# EasyEDA Pro project ProPrj_NRF9151 GILBERTO8_2026-06-28.epro, schematic JCONNECTOR_GILBERTO
Board Name: Board1; Create Date: 2026-04-15; Page Name: P1_nrf9151; Project Name: NRF9151 GILBERTO; Schematic Name: JCONNECTOR_GILBERTO; Update Date: 2026-04-29; Company: EasyEDA.com; Page Size: A4; Version: V1.0
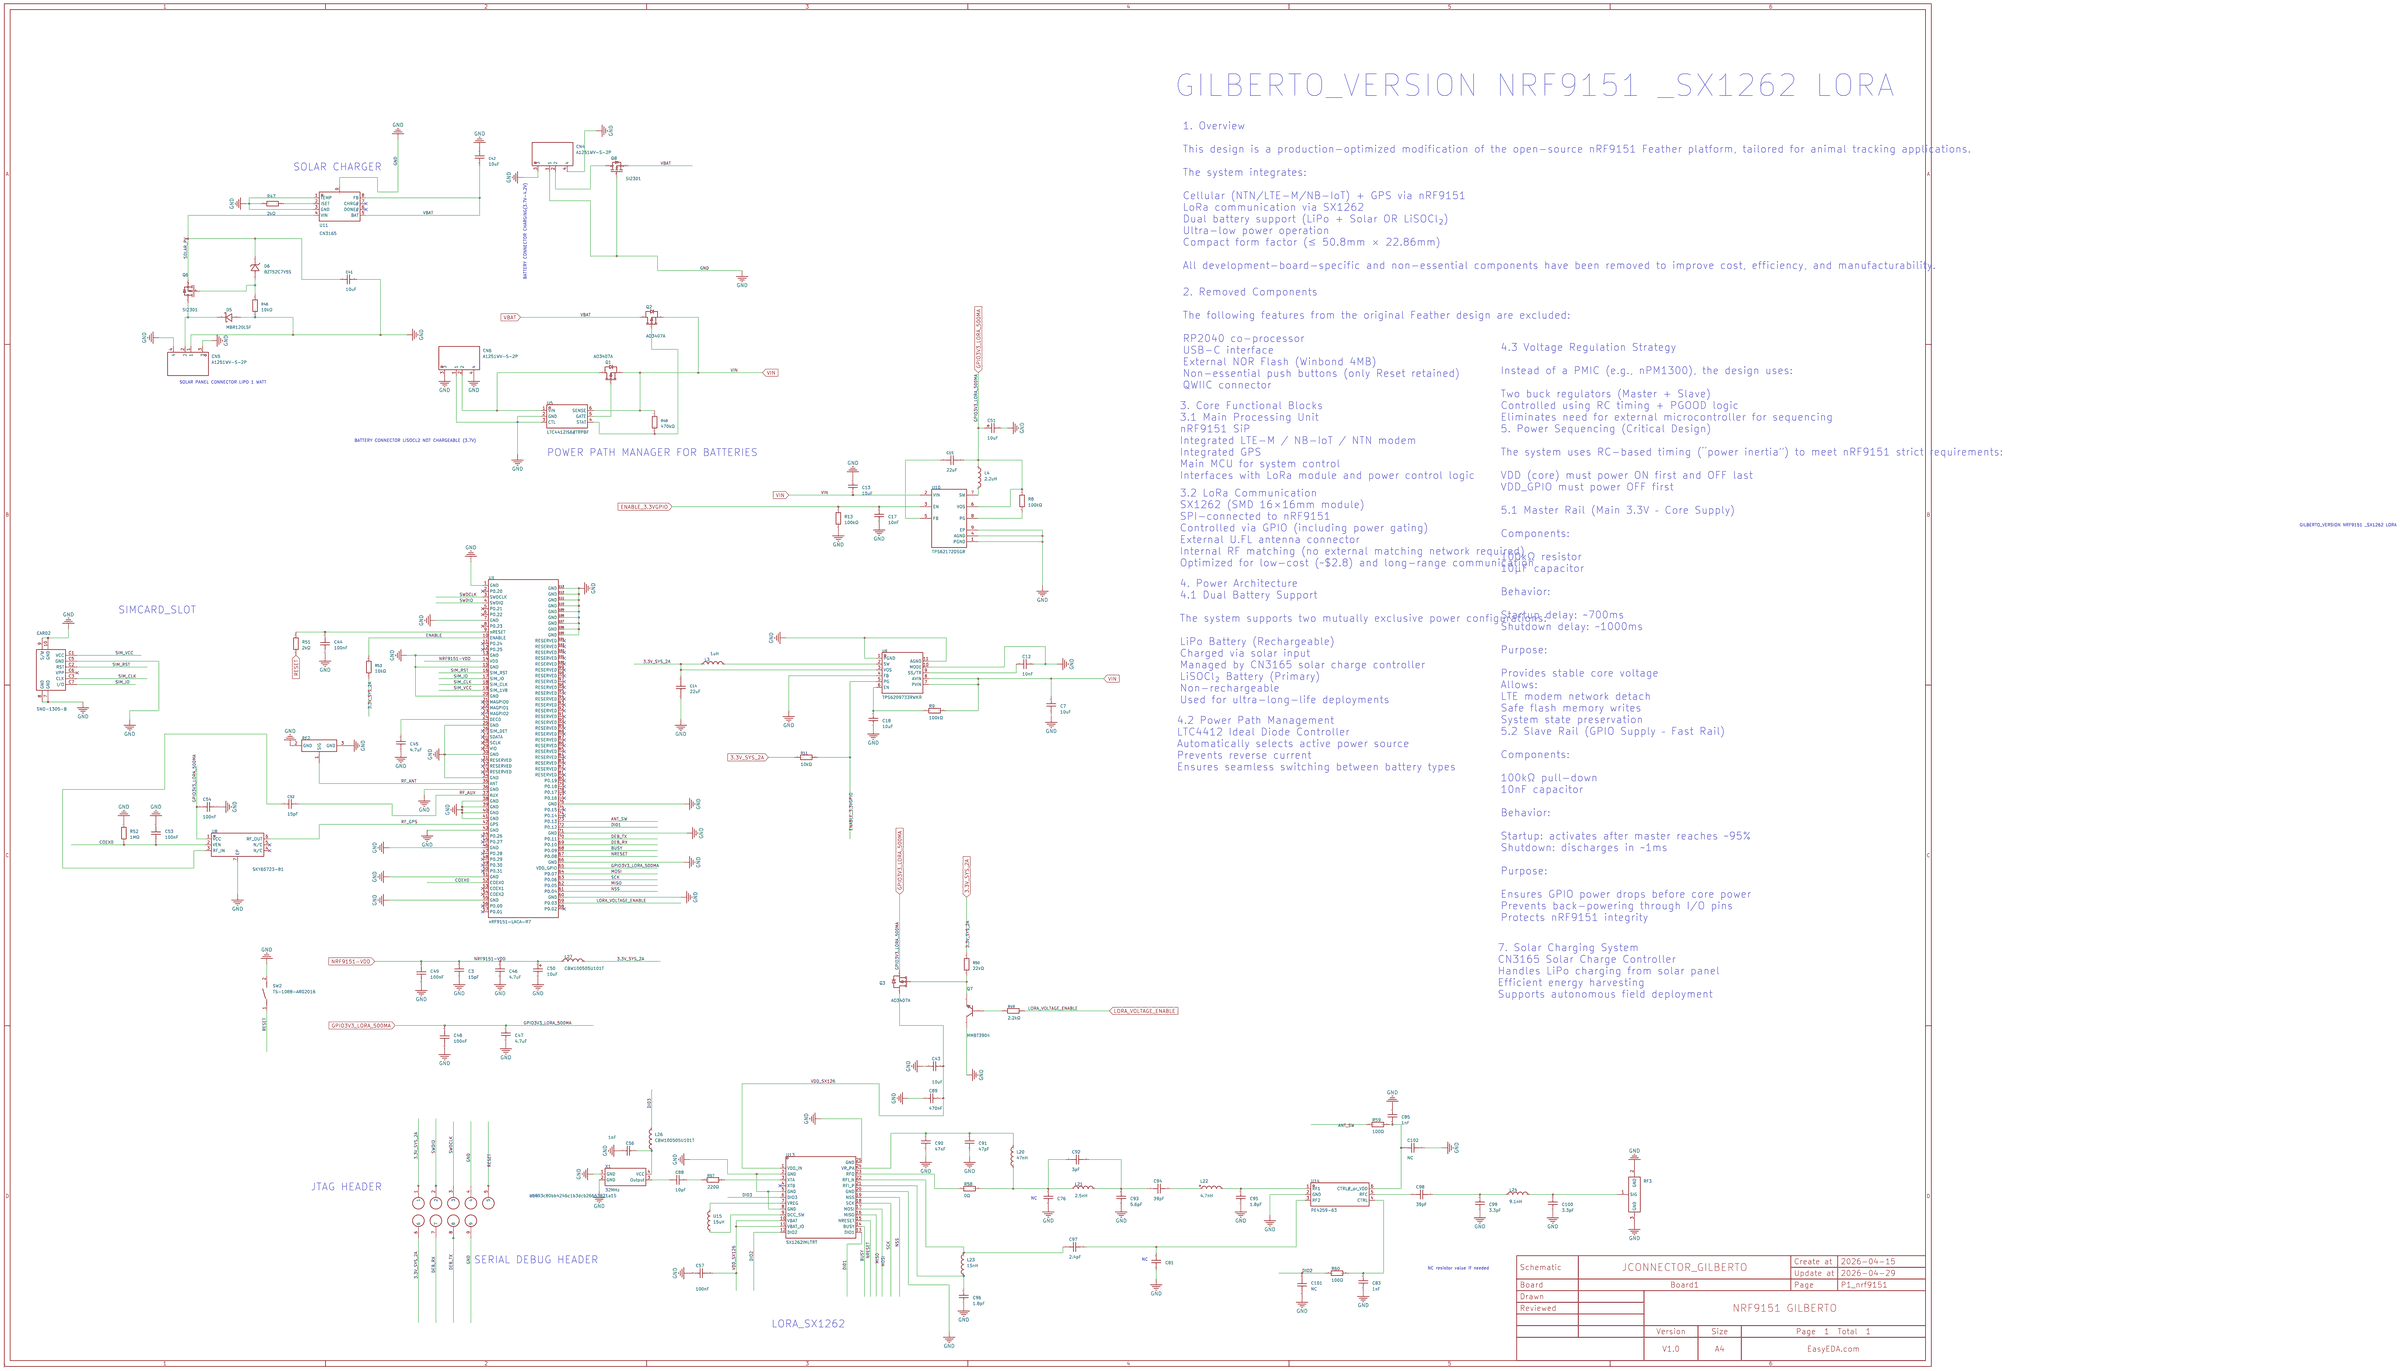
[diagram p0: schematic sheet]

## Parts
C3  15pF  [C0402]
C7  10uF  [C0402]
C12  10nF  [C0402]
C13  10uF  [C0402]
C14  22uF  [C0603]
C15  22uF  [C0603]
C17  10nF  [C0402]
C18  10uF  [C0402]
C41  10uF  [C0402]
C42  10uF  [C0402]
C43  10uF  [C0402]
C44  100nF  [C0402]
C45  4.7uF  [C0402]
C46  4.7uF  [C0402]
C47  4.7uF  [C0402]
C48  100nF  [C0402]
C49  100nF  [C0402]
C50  10uF  [CASE-A_3216]
C51  10uF  [CASE-A_3216]
C52  15pF  [C0201]
C53  100nF  [C0201]
C54  100nF  [C0201]
C56  1nF  [C0402]
C57  100nF  [C0402]
C76  1nF  [C0402]
C81  1nF  [C0402]
C83  1nF  [C0402]
C85  1nF  [C0402]
C88  10pF  [C0402]
C89  470nF  [C0402]
C90  47nF  [C0402]
C91  47pF  [C0402]
C92  3pF  [C0402]
C93  5.6pF  [C0402]
C94  39pF  [C0402]
C95  1.8pF  [C0402]
C96  1.8pF  [C0402]
C97  2.4pF  [C0402]
C98  39pF  [C0402]
C99  3.3pF  [C0402]
C100  3.3pF  [C0402]
C101  NC  [C0603]
C102  NC  [C0603]
CARD2  SNO-1305-B  [SIM-SMD_SIM-1305-6P]
CN4  A1251WV-S-2P  [CONN-SMD_2P-P1.25_A1251WV-S-2P]
CN5  A1251WV-S-2P  [CONN-SMD_2P-P1.25_A1251WV-S-2P]
CN6  A1251WV-S-2P  [CONN-SMD_2P-P1.25_A1251WV-S-2P]
D5  MBR120LSF  [SOD-123_L2.8-W1.8-LS3.7-RD]
D6  BZT52C7V5S  [SOD-323_L1.8-W1.3-LS2.5-RD]
L3  1uH  [IND-SMD_L3.0-W3.0_SWPA3010S]
L4  2.2uH  [L0806]
L20  47nH  [L0402]
L21  2.5nH  [L0201]
L22  4.7nH  [L0402-R-RD]
L23  15nH  [L0402]
L24  9.1nH  [L0402]
L26  CBW100505U101T  [L0402]
L27  CBW100505U101T  [L0402]
Q1  AO3407A  [SOT-23_L2.9-W1.3-P1.90-LS2.4-BR]
Q2  AO3407A  [SOT-23_L2.9-W1.3-P1.90-LS2.4-BR]
Q3  AO3407A  [SOT-23_L2.9-W1.3-P1.90-LS2.4-BR]
Q6  SI2301  [SOT-23-3_L2.9-W1.3-P1.90-LS2.4-BR]
Q7  MMBT3904  [SOT-23-3_L2.9-W1.3-P1.90-LS2.4-BR]
Q8  SI2301  [SOT-23-3_L2.9-W1.3-P1.90-LS2.4-BR]
R8  100kΩ  [R0603]
R9  100kΩ  [R0603]
R11  10kΩ  [R0402]
R13  100kΩ  [R0603]
R46  10kΩ  [R0201]
R47  2kΩ  [R0402]
R48  470kΩ  [R0805]
R49  2.2kΩ  [R0402]
R50  22kΩ  [R0402]
R51  2kΩ  [R0402]
R52  1MΩ  [R0402]
R53  10kΩ  [R0402]
R57  220Ω  [R0402]
R58  0Ω  [R0402]
R59  100Ω  [R0402]
R60  100Ω  [R0402]
RF2  6GHz  [RF-SMD_FRF05002-JSS103M]
RF3  6GHz  [RF-SMD_FRF05002-JSS103M]
SW2  TS-1088-AR02016  [SW-SMD_L3.9-W3.0-P4.45]
U1  nRF9151-LACA-R7  [LGA-113_L12.1-W11.1_NRF9151-LACA-R7]
U5  LTC4412IS6#TRPBF  [SOT-23-6_L2.9-W1.6-P0.95-LS2.8-BL]
U8  SKY65723-81  [MCM-6_L2.3-W1.7-P0.54-TL-EP]
U9  TPS6209733RWKR  [VQFN-11_L2.0-W2.0-P0.50-TL_TI_RWK]
U10  TPS62172DSGR  [WSON-8_L2.0-W2.0-P0.50-TL-EP]
U11  CN3165  [DFN-8_L3.0-W3.0-P0.50-BL-EP]
U13  SX1262IMLTRT  [QFN-24_L4.0-W4.0-P0.50-BL-EP2.6]
U14  PE4259-63  [SC-70-6_L2.2-W1.3-P0.65-LS2.1-BL]
U15  15uH  [L0603]
U16  e0493c80bb4246c1b3dcb26663821a15  [J CONNEXCO]
X1  32MHz  [OSC-SMD_4P-L2.0-W1.6-BL_1XXD]

## Library data of the parts
C3 = 0402CG150J500NT: Capacitance:15pF Tolerance:±5% Tolerance:±5% Voltage Rating:50V Temperature Coefficient:C0G; LCSC Part Name: 15pF ±5% 50V; Supplier Part: C1548; Manufacturer: FH(风华); Supplier Footprint: 0402; Datasheet: https://item.szlcsc.com/datasheet/0402CG150J500NT/1900.html; Supplier: LCSC; Tolerance: ±5%; Voltage Rating: 50V; Temperature Coefficient: C0G
C7 C13 C18 C43 = CL05A106MQ5NUNC: Capacitance:10uF Tolerance:±20% Tolerance:±20% Voltage Rating:6.3V Temperature Coefficient:X5R; LCSC Part Name: 10uF ±20% 6.3V; Supplier Part: C15525; Manufacturer: SAMSUNG(三星); Supplier Footprint: 0402; JLCPCB Part Class: Basic Part; Datasheet: https://item.szlcsc.com/datasheet/CL05A106MQ5NUNC/16204.html; Supplier: LCSC; Tolerance: ±20%; Voltage Rating: 6.3V; Temperature Coefficient: X5R
C12 C17 = 0402B103K500NT: Capacitance:10nF Tolerance:±10% Tolerance:±10% Voltage Rating:50V Temperature Coefficient:X7R; LCSC Part Name: 10nF ±10% 50V; Supplier Part: C1524; Manufacturer: FH(风华); Supplier Footprint: 0402; Datasheet: https://item.szlcsc.com/datasheet/0402B103K500NT/1876.html; Supplier: LCSC; Tolerance: ±10%; Voltage Rating: 50V; Temperature Coefficient: X7R
C14 C15 = GRM188R60J226MEA0D: Capacitance:22uF Tolerance:±20% Tolerance:±20% Voltage Rating:6.3V Temperature Coefficient:X5R; LCSC Part Name: 22uF ±20% 6.3V; Supplier Part: C77042; Manufacturer: muRata(村田); Supplier Footprint: 0603; Datasheet: https://item.szlcsc.com/datasheet/GRM188R60J226MEA0D/78169.html; Supplier: LCSC; Tolerance: ±20%; Voltage Rating: 6.3V; Temperature Coefficient: X5R
C41 C42 = CL05A106MP5NUNC_C315248: Capacitance:10uF Tolerance:±20% Tolerance:±20% Voltage Rating:10V Temperature Coefficient:X5R; LCSC Part Name: 10uF ±20% 10V; Supplier Part: C315248; Manufacturer: SAMSUNG(三星); Manufacturer Part: CL05A106MP5NUNC; Supplier Footprint: 0402; JLCPCB Part Class: Extended Part; Datasheet: https://item.szlcsc.com/datasheet/CL05A106MP5NUNC/297154.html; Supplier: LCSC; Tolerance: ±20%; Voltage Rating: 10V; Temperature Coefficient: X5R
C44 C48 C49 C57 = CL05B104KO5NNNC: Capacitance:100nF Tolerance:±10% Tolerance:±10% Voltage Rating:16V Temperature Coefficient:X7R; LCSC Part Name: 100nF ±10% 16V; Supplier Part: C1525; Manufacturer: SAMSUNG(三星); Supplier Footprint: 0402; JLCPCB Part Class: Basic Part; Datasheet: https://item.szlcsc.com/datasheet/CL05B104KO5NNNC/1877.html; Supplier: LCSC; Tolerance: ±10%; Voltage Rating: 16V; Temperature Coefficient: X7R
C45-C47 = C1005X5R0J475MTJ00E: Capacitance:4.7uF Tolerance:±20% Tolerance:±20% Voltage Rating:6.3V Temperature Coefficient:X5R; LCSC Part Name: 4.7uF ±20% 6.3V; Supplier Part: C23687; Manufacturer: TDK; Supplier Footprint: 0402; Datasheet: https://item.szlcsc.com/datasheet/C1005X5R0J475MTJ00E/24423.html; Supplier: LCSC; Tolerance: ±20%; Voltage Rating: 6.3V; Temperature Coefficient: X5R
C50 C51 = TAJA106K010RNJ: Capacitance:10uF Tolerance:±10% Tolerance:±10% Voltage Rating:10V Equivalent Series Resistance(ESR):3Ω@100kHz Operating Temperature:-55℃~+125℃ Operating Temperature:-55℃~+125℃; LCSC Part Name: 10uF ±10% 10V; Supplier Part: C7177; Manufacturer: Kyocera AVX; Supplier Footprint: CASE-A-3216-18(mm); Supplier: LCSC; Tolerance: ±10%; Voltage Rating: 10V; Equivalent Series Resistance(ESR): 3Ω@100kHz; Operating Temperature: -55℃~+125℃
C52 = 0201CG150J500NT: Capacitance:15pF Tolerance:±5% Tolerance:±5% Voltage Rating:50V Temperature Coefficient:C0G; LCSC Part Name: 15pF ±5% 50V; Supplier Part: C64554; Manufacturer: FH(风华); Supplier Footprint: 0201; Datasheet: https://item.szlcsc.com/datasheet/0201CG150J500NT/65621.html; Supplier: LCSC; Tolerance: ±5%; Voltage Rating: 50V; Temperature Coefficient: C0G
C53 C54 = CL03A104KP3NNNC: Capacitance:100nF Tolerance:±10% Tolerance:±10% Voltage Rating:10V Temperature Coefficient:X5R; LCSC Part Name: 100nF ±10% 10V; Supplier Part: C49062; Manufacturer: SAMSUNG(三星); Supplier Footprint: 0201; JLCPCB Part Class: Extended Part; Datasheet: https://item.szlcsc.com/datasheet/CL03A104KP3NNNC/50070.html; Supplier: LCSC; Tolerance: ±10%; Voltage Rating: 10V; Temperature Coefficient: X5R
C56 = 0402CG102J500NT: Capacitance:1nF Tolerance:±5% Tolerance:±5% Voltage Rating:50V Temperature Coefficient:C0G; LCSC Part Name: 1nF ±5% 50V; Supplier Part: C53547; Manufacturer: FH(风华); Supplier Footprint: 0402; JLCPCB Part Class: Extended Part; Datasheet: https://item.szlcsc.com/datasheet/0402CG102J500NT/54563.html; Supplier: LCSC; Tolerance: ±5%; Voltage Rating: 50V; Temperature Coefficient: C0G
C76 C81 C83 C85 = 0402B102K500NT: Capacitance:1nF Tolerance:±10% Tolerance:±10% Voltage Rating:50V Temperature Coefficient:X7R; LCSC Part Name: 1nF ±10% 50V; Supplier Part: C1523; Manufacturer: FH(风华); Supplier Footprint: 0402; Datasheet: https://item.szlcsc.com/datasheet/0402B102K500NT/1875.html; Supplier: LCSC; Tolerance: ±10%; Voltage Rating: 50V; Temperature Coefficient: X7R
C88 = 0402CG100J500NT: Capacitance:10pF Tolerance:±5% Tolerance:±5% Voltage Rating:50V Temperature Coefficient:C0G; LCSC Part Name: 10pF ±5% 50V; Supplier Part: C1545; Manufacturer: FH(风华); Supplier Footprint: 0402; Datasheet: https://item.szlcsc.com/datasheet/0402CG100J500NT/1897.html; Supplier: LCSC; Tolerance: ±5%; Voltage Rating: 50V; Temperature Coefficient: C0G
C89 = CL05A474KP5NNNC: Capacitance:470nF Tolerance:±10% Tolerance:±10% Voltage Rating:10V Temperature Coefficient:X5R; LCSC Part Name: 470nF ±10% 10V; Supplier Part: C47339; Manufacturer: SAMSUNG(三星); Supplier Footprint: 0402; Datasheet: https://item.szlcsc.com/datasheet/CL05A474KP5NNNC/48344.html; Supplier: LCSC; Tolerance: ±10%; Voltage Rating: 10V; Temperature Coefficient: X5R
C90 = GRM155R71C473KA01D: Capacitance:47nF Tolerance:±10% Tolerance:±10% Voltage Rating:16V Temperature Coefficient:X7R; LCSC Part Name: 47nF ±10% 16V; Supplier Part: C77012; Manufacturer: muRata(村田); Supplier Footprint: 0402; JLCPCB Part Class: Extended Part; Datasheet: https://item.szlcsc.com/datasheet/GRM155R71C473KA01D/78139.html; Supplier: LCSC; Tolerance: ±10%; Voltage Rating: 16V; Temperature Coefficient: X7R
C91 = GRM1555C1H470JA01D: Capacitance:47pF Tolerance:±5% Tolerance:±5% Voltage Rating:50V Temperature Coefficient:C0G; LCSC Part Name: 47pF ±5% 50V; Supplier Part: C76970; Manufacturer: muRata(村田); Supplier Footprint: 0402; JLCPCB Part Class: Extended Part; Datasheet: https://item.szlcsc.com/datasheet/GRM1555C1H470JA01D/78097.html; Supplier: LCSC; Tolerance: ±5%; Voltage Rating: 50V; Temperature Coefficient: C0G
C92 = GJM1555C1H3R0BB01D: Capacitance:3pF Voltage Rating:50V Temperature Coefficient:C0G; LCSC Part Name: ±0.1pF 3pF 50V; Supplier Part: C88891; Manufacturer: muRata(村田); Supplier Footprint: 0402; Datasheet: https://item.szlcsc.com/datasheet/GJM1555C1H3R0BB01D/90071.html; Supplier: LCSC; Voltage Rating: 50V; Temperature Coefficient: C0G
C93 = GRM1555C1H5R6BA01D: Capacitance:5.6pF Voltage Rating:50V Temperature Coefficient:C0G; LCSC Part Name: ±0.1pF 5.6pF 50V; Supplier Part: C76976; Manufacturer: muRata(村田); Supplier Footprint: 0402; JLCPCB Part Class: Extended Part; Datasheet: https://item.szlcsc.com/datasheet/GRM1555C1H5R6BA01D/78103.html; Supplier: LCSC; Voltage Rating: 50V; Temperature Coefficient: C0G
C94 C98 = GCM1555C1H390JA16D: Capacitance:39pF Tolerance:±5% Tolerance:±5% Voltage Rating:50V Temperature Coefficient:C0G; LCSC Part Name: 39pF ±5% 50V; Supplier Part: C343867; Manufacturer: muRata(村田); Supplier Footprint: 0402; JLCPCB Part Class: Extended Part; Datasheet: https://item.szlcsc.com/datasheet/GCM1555C1H390JA16D/320719.html; Supplier: LCSC; Tolerance: ±5%; Voltage Rating: 50V; Temperature Coefficient: C0G
C95 C96 = GJM1555C1H1R8BB01D: Capacitance:1.8pF Voltage Rating:50V Temperature Coefficient:C0G; LCSC Part Name: ±0.1pF 1.8pF 50V; Supplier Part: C76902; Manufacturer: muRata(村田); Supplier Footprint: 0402; JLCPCB Part Class: Extended Part; Datasheet: https://item.szlcsc.com/datasheet/GJM1555C1H1R8BB01D/78029.html; Supplier: LCSC; Voltage Rating: 50V; Temperature Coefficient: C0G
C97 = GJM1555C1H2R4BB01D: Capacitance:2.4pF Voltage Rating:50V Temperature Coefficient:C0G; LCSC Part Name: ±0.1pF 2.4pF 50V; Supplier Part: C88888; Manufacturer: muRata(村田); Supplier Footprint: 0402; JLCPCB Part Class: Extended Part; Datasheet: https://item.szlcsc.com/datasheet/GJM1555C1H2R4BB01D/90068.html; Supplier: LCSC; Voltage Rating: 50V; Temperature Coefficient: C0G
C99 C100 = GJM1555C1H3R3BB01D: Capacitance:3.3pF Voltage Rating:50V Temperature Coefficient:C0G; LCSC Part Name: ±0.1pF 3.3pF 50V; Supplier Part: C76906; Manufacturer: muRata(村田); Supplier Footprint: 0402; Datasheet: https://item.szlcsc.com/datasheet/GJM1555C1H3R3BB01D/78033.html; Supplier: LCSC; Voltage Rating: 50V; Temperature Coefficient: C0G
C101 C102 = CAP_0603: Supplier Footprint: 0603
CARD2 = SNO-1305-B: Card Connection Mode:Hinged Lid Card Type:Nano-SIM Card Connector Type:Connector and Ejector Card Detection:No Card Detect Height Above Board:1.4mm Operating Temperature:-35℃~+75℃ Operating Temperature:-35℃~+75℃; LCSC Part Name: 翻盖式 NanoSIM卡 卡座; Supplier Part: C111371; Manufacturer: SOFNG(硕方); Supplier Footprint: SMD; JLCPCB Part Class: Extended Part; Datasheet: https://item.szlcsc.com/datasheet/SNO-1305-B/112597.html; Supplier: LCSC; Card Connection Mode: Hinged Lid; Card Type: Nano-SIM Card; Connector Type: Connector and Ejector; Card Detection: No Card Detect; Height Above Board: 1.4mm; Operating Temperature: -35℃~+75℃
CN4-CN6 = A1251WV-S-2P: Pins Structure:1x2P Pitch:1.25mm Mounting Type:Surface Mount,Vertical Reference Series:- Number of Pins:2P Number of Rows:1 Number of PINs Per Row:2 Row Spacing:- Current Rating:1A Contact Material:Phosphor Bronze Contact Plating:Tin Operating Temperature; LCSC Part Name: 1x2P 间距:1.25mm 立贴; Supplier Part: C225104; Manufacturer: CJT(长江连接器); Supplier Footprint: SMD,P=1.25mm; JLCPCB Part Class: Extended Part; Datasheet: https://item.szlcsc.com/datasheet/A1251WV-S-2P/225387.html; Supplier: LCSC; Pins Structure: 1x2P; Pitch: 1.25mm; Mounting Type: Surface Mount,Vertical; Number of Pins: 2P; Number of Rows: 1; Number of PINs Per Row: 2; Current Rating: 1A; Contact Material: Phosphor Bronze; Contact Plating: Tin; Operating Temperature: -40℃~+105℃; Voltage Rating: 125V; Plastic Material: LCP; Flame Retardant Rating: UL94V-0
D5 = MBR120LSF: Diode Configuration:Independent Voltage - Forward(Vf@If):600mV@1A Voltage - DC Reverse(Vr):20V Current - Rectified:1A Reverse Leakage Current (Ir):1mA@20V Non-Repetitive Peak Forward Surge Current:25A; LCSC Part Name: 电压:20V 电流:1A; Supplier Part: C130880; Manufacturer: SHIKUES(时科); Supplier Footprint: SOD-123; JLCPCB Part Class: Extended Part; Datasheet: https://item.szlcsc.com/datasheet/MBR120LSF/142169.html; Supplier: LCSC; Diode Configuration: Independent; Voltage - Forward(Vf@If): 600mV@1A; Voltage - DC Reverse(Vr): 20V; Current - Rectified: 1A; Reverse Leakage Current (Ir): 1mA@20V; Non-Repetitive Peak Forward Surge Current: 25A
D6 = BZT52C7V5S_C5270778: Diode Configuration:1 Independent Zener Voltage(Nom):7V Reverse Leakage Current (Ir):1uA@5V Zener Voltage(Range):7.5V~7.9V Zener Voltage(Range):7.5V~7.9V Pd - Power Dissipation:200mW Impedance(Zzt):15Ω Impedance(Zzk):80Ω; LCSC Part Name: 独立式 耐压:7V 电流:1uA@5.0V; Supplier Part: C5270778; Manufacturer: YFW(佑风微); Supplier Footprint: SOD-323; JLCPCB Part Class: Extended Part; Datasheet: https://item.szlcsc.com/datasheet/BZT52C7V5S/5997207.html; Supplier: LCSC; Diode Configuration: 1 Independent; Zener Voltage(Nom): 7V; Reverse Leakage Current (Ir): 1uA@5V; Zener Voltage(Range): 7.5V~7.9V; Pd - Power Dissipation: 200mW; Impedance(Zzt): 15Ω; Impedance(Zzk): 80Ω
L3 = SWPA3015S1R0NT: Inductance: Tolerance:±30% Tolerance:±30% Rated Current: Current - Saturation(Isat):2.8A DC Resistance(DCR): Type:- Ratings:-; LCSC Part Name: 1uH ±30% 2.8A; Supplier Part: C43388; Manufacturer: Sunlord(顺络); Supplier Footprint: SMD,3x3mm; JLCPCB Part Class: Extended Part; Datasheet: https://atta.szlcsc.com/upload/public/pdf/source/20231024/317626D2AA2F8AB4113C1875E432E6E1.pdf; Supplier: LCSC; Tolerance: ±30%; Current - Saturation(Isat): 2.8A
L4 = MLP2016V2R2MT0S1: Inductance:2.2uH Tolerance:±20% Tolerance:±20% Current Rating:1A Current - Saturation (Isat):- DC Resistance(DCR):170mΩ Q @ Frequency:- Frequency - Self Resonant:- Ratings:-; LCSC Part Name: 2.2uH ±20%; Supplier Part: C307746; Manufacturer: TDK; Supplier Footprint: 0806; JLCPCB Part Class: Extended Part; Datasheet: https://item.szlcsc.com/datasheet/MLP2016V2R2MT0S1/291420.html; Supplier: LCSC; Tolerance: ±20%; Current Rating: 1A; DC Resistance(DCR): 170mΩ
L20 = LQG15HH47NH02D: Inductance: Tolerance:±3% Tolerance:±3% Rated Current: Saturation Current (Isat):- DC Resistance (DCR): Q @ Freq:8@100MHz Frequency - Self Resonant: Ratings:AEC-Q200; LCSC Part Name: 47nH ±3%; Supplier Part: C2042001; Manufacturer: muRata(村田); Supplier Footprint: 0402; JLCPCB Part Class: Extended Part; Datasheet: https://atta.szlcsc.com/upload/public/pdf/source/20201110/C913594_35623EBE2A582BB18A46746E227A8E3C.pdf; Supplier: LCSC; Tolerance: ±3%; Q @ Freq: 8@100MHz; Ratings: AEC-Q200
L21 = LQP03HQ2N5B02D: Inductance: Tolerance:- Tolerance:- Rated Current: Saturation Current (Isat):- DC Resistance (DCR): Q @ Freq:20@500MHz Frequency - Self Resonant:9GHz Ratings: Type:Thick Film Inductor; Supplier Part: C237441; Manufacturer: muRata(村田); Supplier Footprint: 0201; Datasheet: https://atta.szlcsc.com/upload/public/pdf/source/20181120/C333991_3B037B5A0300CC3F313E5A09B9D1E037.pdf; Supplier: LCSC; Q @ Freq: 20@500MHz; Frequency - Self Resonant: 9GHz; Type: Thick Film Inductor
L22 = LQG15HS4N7S02D: Inductance:4.7nH Tolerance:- Tolerance:- Current Rating:700mA Current - Saturation (Isat):- DC Resistance(DCR):160mΩ Q @ Frequency:8@100MHz Frequency - Self Resonant:6GHz Ratings:-; Supplier Part: C86065; Manufacturer: muRata(村田); Supplier Footprint: 0402; Datasheet: https://item.szlcsc.com/datasheet/LQG15HS4N7S02D/87241.html; Supplier: LCSC; Current Rating: 700mA; DC Resistance(DCR): 160mΩ; Q @ Frequency: 8@100MHz; Frequency - Self Resonant: 6GHz
L23 = LQG15HS15NJ02D: Inductance:15nH Tolerance:±5% Tolerance:±5% Current Rating:450mA Current - Saturation (Isat):- DC Resistance(DCR):320mΩ Q @ Frequency:8@100MHz Frequency - Self Resonant:2.5GHz Ratings:-; LCSC Part Name: 15nH ±5%; Supplier Part: C86059; Manufacturer: muRata(村田); Supplier Footprint: 0402; JLCPCB Part Class: Extended Part; Datasheet: https://item.szlcsc.com/datasheet/LQG15HS15NJ02D/87235.html; Supplier: LCSC; Tolerance: ±5%; Current Rating: 450mA; DC Resistance(DCR): 320mΩ; Q @ Frequency: 8@100MHz; Frequency - Self Resonant: 2.5GHz
L24 = LQG15HN9N1J02D: Inductance: Tolerance:±5% Tolerance:±5% Rated Current: Saturation Current (Isat):- DC Resistance (DCR): Q @ Freq:8@100MHz Frequency - Self Resonant: Ratings:; LCSC Part Name: 9.1nH ±5%; Supplier Part: C113059; Manufacturer: muRata(村田); Supplier Footprint: 0402; Datasheet: https://atta.szlcsc.com/upload/public/pdf/source/20170523/1495533989819.pdf; Supplier: LCSC; Tolerance: ±5%; Q @ Freq: 8@100MHz
L26 L27 = CBW100505U101T: Impedance @ Frequency:100Ω@100MHz Tolerance:±25% Tolerance:±25% DC Resistance(DCR):200mΩ Current Rating:450mA Number of Circuits:1; LCSC Part Name: 单路 0402磁珠 阻抗100Ω@100MHz; Supplier Part: C124089; Manufacturer: FH(风华); Supplier Footprint: 0402; Datasheet: https://item.szlcsc.com/datasheet/CBW100505U101T/125363.html; Supplier: LCSC; Impedance @ Frequency: 100Ω@100MHz; Tolerance: ±25%; DC Resistance(DCR): 200mΩ; Current Rating: 450mA; Number of Circuits: 1
Q1-Q3 = AO3407A_C347478: Number:1 P-Channel Drain to Source Voltage:30V Current - Continuous Drain(Id):4.2A RDS(on):37mΩ@10V；52mΩ@4.5V Pd - Power Dissipation:1.4W Gate Threshold Voltage (Vgs(th)):1.8V@250uA Gate Charge(Qg):14.3nC@4.5V Input Capacitance(Ciss):700pF Reverse Transfe; LCSC Part Name: 1个P沟道 耐压:30V 电流:4.2A; Supplier Part: C347478; Manufacturer: UMW(友台半导体); Supplier Footprint: SOT-23; Datasheet: https://item.szlcsc.com/datasheet/AO3407A/324138.html; Supplier: LCSC; Number: 1 P-Channel; Drain to Source Voltage: 30V; Current - Continuous Drain(Id): 4.2A; RDS(on): 37mΩ@10V；52mΩ@4.5V; Pd - Power Dissipation: 1.4W; Gate Threshold Voltage (Vgs(th)): 1.8V@250uA; Gate Charge(Qg): 14.3nC@4.5V; Input Capacitance(Ciss): 700pF; Reverse Transfer Capacitance (Crss@Vds): 75pF
Q6 Q8 = SI2301_C181086: Number:1 P-Channel Drain to Source Voltage:20V Current - Continuous Drain(Id):3A RDS(on):115mΩ@2.5V,1.0A Pd - Power Dissipation:1.6W Gate Threshold Voltage (Vgs(th)):1V@250uA Gate Charge(Qg):10nC@4.5V Input Capacitance(Ciss):405pF Reverse Transfer Capacit; LCSC Part Name: 1个P沟道 耐压:20V 电流:3A; Supplier Part: C181086; Manufacturer: Hottech(合科泰); Supplier Footprint: SOT-23; JLCPCB Part Class: Extended Part; Datasheet: https://item.szlcsc.com/datasheet/SI2301/192483.html; Supplier: LCSC; Number: 1 P-Channel; Drain to Source Voltage: 20V; Current - Continuous Drain(Id): 3A; RDS(on): 115mΩ@2.5V,1.0A; Pd - Power Dissipation: 1.6W; Gate Threshold Voltage (Vgs(th)): 1V@250uA; Gate Charge(Qg): 10nC@4.5V; Input Capacitance(Ciss): 405pF; Reverse Transfer Capacitance (Crss@Vds): 55pF; Operating Temperature: -55℃~+150℃; Type: P-Channel; Output Capacitance(Coss): 75pF
Q7 = MMBT3904_C84104: type:NPN Current - Collector(Ic):200mA Collector - Emitter Voltage VCEO:40V Pd - Power Dissipation:350mW DC Current Gain:100@10mA,1V DC Current Gain:100@10mA,1V Transition frequency(fT):300MHz Current - Collector Cutoff:50nA Vce Saturation(VCE(sat)):300mV; LCSC Part Name: 此款型号丝印有4种:1AM,1E,T1A,T04,会随机发货 NPN 电流:200mA 电压:40V; Supplier Part: C84104; Manufacturer: ST(先科); Supplier Footprint: SOT-23; Datasheet: https://item.szlcsc.com/datasheet/MMBT3904/85272.html; Supplier: LCSC; type: NPN; Current - Collector(Ic): 200mA; Collector - Emitter Voltage VCEO: 40V; Pd - Power Dissipation: 350mW; DC Current Gain: 100@10mA,1V; Transition frequency(fT): 300MHz; Current - Collector Cutoff: 50nA; Vce Saturation(VCE(sat)): 300mV; Emitter-Base Voltage(Vebo): 6V
R8 R9 R13 = 0603WAF1003T5E: Type:Thick Film Resistor Resistance:100kΩ Tolerance:±1% Tolerance:±1% Power(Watts):100mW Voltage-Supply(Max):75V Temperature Coefficient:±100ppm/℃ Temperature Coefficient:±100ppm/℃ Operating Temperature:-55℃~+155℃ Operating Temperature:-55℃~+155℃; LCSC Part Name: 100kΩ ±1% 100mW 厚膜电阻; Supplier Part: C25803; Manufacturer: UNI-ROYAL(厚声); Supplier Footprint: 0603; Datasheet: https://item.szlcsc.com/datasheet/0603WAF1003T5E/26546.html; Supplier: LCSC; Type: Thick Film Resistor; Tolerance: ±1%; Power(Watts): 100mW; Voltage-Supply(Max): 75V; Temperature Coefficient: ±100ppm/℃; Operating Temperature: -55℃~+155℃
R11 R53 = 0402WGJ0103TCE: Type:Thick Film Resistor Resistance:10kΩ Tolerance:±5% Tolerance:±5% Power(Watts):62.5mW Voltage-Supply(Max):50V Temperature Coefficient:±100ppm/℃ Temperature Coefficient:±100ppm/℃ Operating Temperature:-55℃~+155℃ Operating Temperature:-55℃~+155℃; LCSC Part Name: 10kΩ ±5% 62.5mW 厚膜电阻; Supplier Part: C25531; Manufacturer: UNI-ROYAL(厚声); Supplier Footprint: 0402; Datasheet: https://item.szlcsc.com/datasheet/0402WGJ0103TCE/26274.html; Supplier: LCSC; Type: Thick Film Resistor; Tolerance: ±5%; Power(Watts): 62.5mW; Voltage-Supply(Max): 50V; Temperature Coefficient: ±100ppm/℃; Operating Temperature: -55℃~+155℃
R46 = RC0201FR-0710KL: Type:Thick Film Resistor Resistance:10kΩ Tolerance:±1% Tolerance:±1% Power(Watts):50mW Voltage-Supply(Max):25V Temperature Coefficient:±200ppm/℃ Temperature Coefficient:±200ppm/℃ Operating Temperature:-55℃~+125℃ Operating Temperature:-55℃~+125℃; LCSC Part Name: 厚膜电阻 10kΩ ±1% 50mW; Supplier Part: C106225; Manufacturer: YAGEO(国巨); Supplier Footprint: 0201; JLCPCB Part Class: Extended Part; Datasheet: https://item.szlcsc.com/datasheet/RC0201FR-0710KL/107440.html; Supplier: LCSC; Type: Thick Film Resistor; Tolerance: ±1%; Power(Watts): 50mW; Voltage-Supply(Max): 25V; Temperature Coefficient: ±200ppm/℃; Operating Temperature: -55℃~+125℃
R47 R51 = RC0402FR-072KL: Type:Thick Film Resistor Resistance:2kΩ Tolerance:±1% Tolerance:±1% Power(Watts):62.5mW Voltage-Supply(Max):50V Temperature Coefficient:±100ppm/℃ Temperature Coefficient:±100ppm/℃ Operating Temperature:-55℃~+155℃ Operating Temperature:-55℃~+155℃; LCSC Part Name: 厚膜电阻 2kΩ ±1% 62.5mW; Supplier Part: C60488; Manufacturer: YAGEO(国巨); Supplier Footprint: 0402; JLCPCB Part Class: Extended Part; Datasheet: https://item.szlcsc.com/datasheet/RC0402FR-072KL/61540.html; Supplier: LCSC; Type: Thick Film Resistor; Tolerance: ±1%; Power(Watts): 62.5mW; Voltage-Supply(Max): 50V; Temperature Coefficient: ±100ppm/℃; Operating Temperature: -55℃~+155℃
R48 = 0805W8F4703T5E: Type:Thick Film Resistor Resistance:470kΩ Tolerance:±1% Tolerance:±1% Power(Watts):125mW Voltage-Supply(Max):150V Temperature Coefficient:±100ppm/℃ Temperature Coefficient:±100ppm/℃ Operating Temperature:-55℃~+155℃ Operating Temperature:-55℃~+155℃; LCSC Part Name: 470kΩ ±1% 125mW 厚膜电阻; Supplier Part: C17709; Manufacturer: UNI-ROYAL(厚声); Supplier Footprint: 0805; Datasheet: https://item.szlcsc.com/datasheet/0805W8F4703T5E/18397.html; Supplier: LCSC; Type: Thick Film Resistor; Tolerance: ±1%; Power(Watts): 125mW; Voltage-Supply(Max): 150V; Temperature Coefficient: ±100ppm/℃; Operating Temperature: -55℃~+155℃
R49 = 0402WGF2201TCE: Type:Thick Film Resistor Resistance:2.2kΩ Tolerance:±1% Tolerance:±1% Power(Watts):62.5mW Voltage-Supply(Max):50V Temperature Coefficient:±100ppm/℃ Temperature Coefficient:±100ppm/℃ Operating Temperature:-55℃~+155℃ Operating Temperature:-55℃~+155℃; LCSC Part Name: 2.2kΩ ±1% 62.5mW 厚膜电阻; Supplier Part: C25879; Manufacturer: UNI-ROYAL(厚声); Supplier Footprint: 0402; Datasheet: https://item.szlcsc.com/datasheet/0402WGF2201TCE/26622.html; Supplier: LCSC; Type: Thick Film Resistor; Tolerance: ±1%; Power(Watts): 62.5mW; Voltage-Supply(Max): 50V; Temperature Coefficient: ±100ppm/℃; Operating Temperature: -55℃~+155℃
R50 = 0402WGJ0223TCE: Type:Thick Film Resistor Resistance:22kΩ Tolerance:±5% Tolerance:±5% Power(Watts):62.5mW Voltage-Supply(Max):50V Temperature Coefficient:±100ppm/℃ Temperature Coefficient:±100ppm/℃ Operating Temperature:-55℃~+155℃ Operating Temperature:-55℃~+155℃; LCSC Part Name: 22kΩ ±5% 62.5mW 厚膜电阻; Supplier Part: C25547; Manufacturer: UNI-ROYAL(厚声); Supplier Footprint: 0402; Datasheet: https://item.szlcsc.com/datasheet/0402WGJ0223TCE/26290.html; Supplier: LCSC; Type: Thick Film Resistor; Tolerance: ±5%; Power(Watts): 62.5mW; Voltage-Supply(Max): 50V; Temperature Coefficient: ±100ppm/℃; Operating Temperature: -55℃~+155℃
R52 = CR0402FF1004G: Type:Thick Film Resistors Resistance: Tolerance:±1% Tolerance:±1% Power(Watts): Overload Voltage (Max): Temperature Coefficient:±200ppm/℃ Temperature Coefficient:±200ppm/℃ Operating Temperature Range:-55℃~+125℃ Operating Temperature Range:-55℃~+125℃; LCSC Part Name: 厚膜电阻 1MΩ ±1% 62.5mW; Supplier Part: C100198; Manufacturer: LIZ(丽智电子); Supplier Footprint: 0402; JLCPCB Part Class: Extended Part; Datasheet: https://atta.szlcsc.com/upload/public/pdf/source/20180403/C189438_6D658388CC7843F35BBC9018D03F0B8E.pdf; Supplier: LCSC; Type: Thick Film Resistors; Tolerance: ±1%; Temperature Coefficient: ±200ppm/℃; Operating Temperature Range: -55℃~+125℃
R57 = 0402WGF2200TCE: Type:Thick Film Resistor Resistance:220Ω Tolerance:±1% Tolerance:±1% Power(Watts):62.5mW Voltage-Supply(Max):50V Temperature Coefficient:±100ppm/℃ Temperature Coefficient:±100ppm/℃ Operating Temperature:-55℃~+155℃ Operating Temperature:-55℃~+155℃; LCSC Part Name: 220Ω ±1% 62.5mW 厚膜电阻; Supplier Part: C25091; Manufacturer: UNI-ROYAL(厚声); Supplier Footprint: 0402; JLCPCB Part Class: Basic Part; Datasheet: https://item.szlcsc.com/datasheet/0402WGF2200TCE/25834.html; Supplier: LCSC; Type: Thick Film Resistor; Tolerance: ±1%; Power(Watts): 62.5mW; Voltage-Supply(Max): 50V; Temperature Coefficient: ±100ppm/℃; Operating Temperature: -55℃~+155℃
R58 = CRCW04020000Z0ED: Type:Thick Film Resistors Resistance:0Ω Tolerance:- Tolerance:- Power(Watts):62.5mW Voltage-Supply(Max):50V Temperature Coefficient:- Temperature Coefficient:- Operating Temperature:-55℃~+155℃ Operating Temperature:-55℃~+155℃; LCSC Part Name: 厚膜电阻 0Ω 62.5mW; Supplier Part: C190119; Manufacturer: VISHAY(威世); Supplier Footprint: 0402; Datasheet: https://item.szlcsc.com/datasheet/CRCW04020000Z0ED/208652.html; Supplier: LCSC; Type: Thick Film Resistors; Power(Watts): 62.5mW; Voltage-Supply(Max): 50V; Operating Temperature: -55℃~+155℃
R59 R60 = 0402WGF1000TCE: Type:Thick Film Resistors Resistance: Tolerance:±1% Tolerance:±1% Power(Watts): Overload Voltage (Max): Temperature Coefficient:±200ppm/℃ Temperature Coefficient:±200ppm/℃ Operating Temperature Range:-55℃~+155℃ Operating Temperature Range:-55℃~+155℃; LCSC Part Name: 100Ω ±1% 62.5mW 厚膜电阻; Supplier Part: C25076; Manufacturer: UNI-ROYAL(厚声); Supplier Footprint: 0402; Datasheet: https://atta.szlcsc.com/upload/public/pdf/source/20200306/C422600_1E6D84923E4A46A82E41ADD87F860B5C.pdf; Supplier: LCSC; Type: Thick Film Resistors; Tolerance: ±1%; Temperature Coefficient: ±200ppm/℃; Operating Temperature Range: -55℃~+155℃
RF2 RF3 = U.FL-R-SMT-1(80)_C88374: Connector Type:Board Side Interface:Male Pin Number of Ports:1 Interface Diameter:2mm Interface Length/Height:1.25mm Frequency:6GHz RF Series:IPEX Impedance:50Ω Style:- Operating Temperature Range:-40℃~+90℃ Operating Temperature Range:-40℃~+90℃; LCSC Part Name: IPEX 内针; Supplier Part: C88374; Manufacturer: HRS(广濑); Manufacturer Part: U.FL-R-SMT-1(80); Supplier Footprint: SMD; JLCPCB Part Class: Extended Part; Datasheet: https://item.szlcsc.com/datasheet/U.FL-R-SMT-1(80)/89553.html; Supplier: LCSC; Connector Type: Board Side; Interface: Male Pin; Number of Ports: 1; Interface Diameter: 2mm; Interface Length/Height: 1.25mm; RF Series: IPEX; Impedance: 50Ω; Operating Temperature Range: -40℃~+90℃
SW2 = TS-1088-AR02016: Circuit:SPST Actuator Style:Round Button Operating Force:1.6N Mounting Type:Surface Mount,Vertical Length:4mm Width:3mm Switch Height:2mm with Bracket:Without Bracket Contact Current:50mA Voltage Rating:12V Actuator/Cap Color:Black Termination Style:SMD(S; LCSC Part Name: 4*3*2mm 立贴 轻触开关; Supplier Part: C720477; Manufacturer: XUNPU(讯普); Supplier Footprint: SMD,4x3mm; JLCPCB Part Class: Basic Part; Datasheet: https://item.szlcsc.com/datasheet/TS-1088-AR02016/763484.html; Supplier: LCSC; Circuit: SPST; Actuator Style: Round Button; Operating Force: 1.6N; Mounting Type: Surface Mount,Vertical; Length: 4mm; Width: 3mm; Switch Height: 2mm; with Bracket: Without Bracket; Contact Current: 50mA; Voltage Rating: 12V; Actuator/Cap Color: Black; Termination Style: SMD(SMT) Tab; Life: 100,000 Cycles; Operating Temperature: -30℃~+80℃
U1 = NRF9151-LACA-R_C42236596: LGA-113(12.1x11.1) RF Modules ROHS; LCSC Part Name: NRF9151-LACA-R; Supplier Part: C22397843; Manufacturer: Nordic Semicon; Supplier Footprint: LGA-113(12.1x11.1); JLCPCB Part Class: Extended Part; Datasheet: https://atta.szlcsc.com/upload/public/pdf/source/20250220/C59DB80833A870E26845E8E79822579D.pdf; Supplier: JLCPCB
U5 = LTC4412IS6#TRPBF_C521306: Load Type:MOSFET Voltage - Supply:2.5V~28V Voltage - Supply:2.5V~28V Operating Temperature:-40℃~+85℃ Operating Temperature:-40℃~+85℃; LCSC Part Name: 低损耗PowerPath控制器; Supplier Part: C521306; Manufacturer: ADI(亚德诺); Supplier Footprint: TSOT-23-6L; Datasheet: https://item.szlcsc.com/datasheet/LTC4412IS6%2523TRPBF/538676.html; Supplier: LCSC; Load Type: MOSFET; Voltage - Supply: 2.5V~28V; Operating Temperature: -40℃~+85℃
U8 = SKY65723-81: Frequency Range:1.559GHz~1.606GHz Frequency Range:1.559GHz~1.606GHz Gain:16.8dB Noise Figure:1.6dB Voltage - Supply:1.62V~3.6V Voltage - Supply:1.62V~3.6V Current - Supply:4.2mA; Supplier Part: C2654196; Manufacturer: SKYWORKS; Supplier Footprint: MCM-6(1.7x2.3); Datasheet: https://item.szlcsc.com/datasheet/SKY65723-81/2746105.html; Supplier: LCSC; Frequency Range: 1.559GHz~1.606GHz; Gain: 16.8dB; Noise Figure: 1.6dB; Voltage - Supply: 1.62V~3.6V; Current - Supply: 4.2mA
U9 = TPS6209733RWKR: Function:Buck Voltage - Supply:2.5V~6V Voltage - Supply:2.5V~6V Output Voltage:3.3V Output Voltage:3.3V Output Current:2A Frequency - Switching:2.5MHz Frequency - Switching:2.5MHz Operating Temperature:-40℃~+125℃@(TJ) Operating Temperature:-40℃~+125℃@(TJ); LCSC Part Name: 降压型 2A 2.5V~6V; Supplier Part: C2071261; Manufacturer: TI(德州仪器); Supplier Footprint: VQFN-11(2x2); JLCPCB Part Class: Extended Part; Datasheet: https://www.ti.com/cn/lit/gpn/tps62097; Supplier: LCSC; Function: Buck; Voltage - Supply: 2.5V~6V; Output Voltage: 3.3V; Output Current: 2A; Frequency - Switching: 2.5MHz; Operating Temperature: -40℃~+125℃@(TJ); Synchronous Rectifier: Yes; Number of Outputs: 1; Topology: Buck; Quiescent Current: 57uA; Switch tube (built-in/external): Built-in; Output Type: Fixed
U10 = TPS62172DSGR: Function:Buck Voltage - Supply:3V~17V Voltage - Supply:3V~17V Output Voltage:3.3V Output Voltage:3.3V Output Current:500mA Frequency - Switching:2.25MHz Frequency - Switching:2.25MHz Operating Temperature:-40℃~+85℃@(TA) Operating Temperature:-40℃~+85℃@(TA; LCSC Part Name: 降压型 500mA 3V~17V; Supplier Part: C59873; Manufacturer: TI(德州仪器); Supplier Footprint: WSON-8-EP(2x2); Datasheet: https://www.ti.com/cn/lit/gpn/tps62172; Supplier: LCSC; Function: Buck; Voltage - Supply: 3V~17V; Output Voltage: 3.3V; Output Current: 500mA; Frequency - Switching: 2.25MHz; Operating Temperature: -40℃~+85℃@(TA); Synchronous Rectifier: Yes; Number of Outputs: 1; Topology: Buck; Quiescent Current: 17uA; Switch tube (built-in/external): Built-in; Output Type: Fixed
U11 = CN3165: The Chip Type:Charging IC Voltage - Supply:4.4V~6V Voltage - Supply:4.4V~6V Charge Current - Max:- Charging Saturation Voltage:4.2V End-Off Voltage:- Type of Battery:Lithium Battery Number of Cells:1 Number of Cells:1 Operating Temperature:-40℃~+85℃ Opera; LCSC Part Name: 可用太阳能板供电的锂电池充电管理芯片; Supplier Part: C559035; Manufacturer: CONSONANCE(上海如韵); Supplier Footprint: DFN-8-EP(3x3); JLCPCB Part Class: Extended Part; Datasheet: https://item.szlcsc.com/datasheet/CN3165/582675.html; Supplier: LCSC; The Chip Type: Charging IC; Voltage - Supply: 4.4V~6V; Charging Saturation Voltage: 4.2V; Type of Battery: Lithium Battery; Number of Cells: 1; Operating Temperature: -40℃~+85℃; Battery Temperature Detection: Support; Supply Current (Iq): 3uA
U13 = SX1262IMLTRT: Frequency Range:- Frequency Range:- Interface:SPI Voltage - Supply:1.8V~3.7V Voltage - Supply:1.8V~3.7V Applications:General-purposeISM Output Power:22dBm Data Rate:300Kbps Current Of Transmitting:32mA Sensitivity:-148dBm Receive Current:4.2mA Operating T; Supplier Part: C191341; Manufacturer: SEMTECH; Supplier Footprint: QFN-24-EP(4x4); JLCPCB Part Class: Extended Part; Datasheet: https://item.szlcsc.com/datasheet/SX1262IMLTRT/216566.html; Supplier: LCSC; Interface: SPI; Voltage - Supply: 1.8V~3.7V; Applications: General-purposeISM; Output Power: 22dBm; Data Rate: 300Kbps; Current Of Transmitting: 32mA; Sensitivity: -148dBm; Receive Current: 4.2mA; Operating Temperature: -40℃~+85℃
U14 = PE4259-63: Frequency range:- Frequency range:- isolation:30dB Insertion loss:0.35dB Voltage - Supply:1.8V~3.3V Voltage - Supply:1.8V~3.3V operating temperature:-40℃~+85℃ operating temperature:-40℃~+85℃; LCSC Part Name: 10MHz-3.0GHzSPDT高功率UltraCMOS射频开关; Supplier Part: C470892; Manufacturer: pSemi(游隼半导体); Supplier Footprint: SC-70-6; Datasheet: https://item.szlcsc.com/datasheet/PE4259-63/477154.html; Supplier: LCSC; isolation: 30dB; Insertion loss: 0.35dB; Voltage - Supply: 1.8V~3.3V; operating temperature: -40℃~+85℃
U15 = CMI160808J150KT: Inductance: Tolerance:±10% Tolerance:±10%; LCSC Part Name: 15uH ±10%; Supplier Part: C394963; Manufacturer: FH(风华); Supplier Footprint: 0603; Datasheet: https://atta.szlcsc.com/upload/public/pdf/source/20230223/55F203729CE6F04E1707F35DF12034EB.pdf; Supplier: LCSC; Tolerance: ±10%
U16 = J CONNEXTOR89
X1 = 1XXD32000MBA_C253694: Frequency:32MHz Frequency Stability:±1.5ppm Frequency Stability:±1.5ppm Voltage - Supply:3.3V Voltage - Supply:3.3V Current - Supply:2mA Operating Temperature:-40℃~+85℃ Operating Temperature:-40℃~+85℃; LCSC Part Name: 32MHz ±1.5ppm 3.3V; Supplier Part: C253694; Manufacturer: KDS(大真空); Manufacturer Part: 1XXD32000MBA; Supplier Footprint: SMD2016-4P; JLCPCB Part Class: Extended Part; Datasheet: https://atta.szlcsc.com/upload/public/pdf/source/20190821/C253694_72384EA4206516DFBD37E4C5D3353B3C.pdf; Supplier: LCSC; Frequency Stability: ±1.5ppm; Voltage - Supply: 3.3V; Current - Supply: 2mA; Operating Temperature: -40℃~+85℃

## Nets
3.3V_SYS_2A: C14.2 L3.2 L27.2 R11.1 R50.2 R53.1 U9.3(VOS) U16.1 U16.6
GND: C3.1 C7.1 C12.1 C13.1 C14.1 C17.1 C18.1 C41.1 C42.1 C43.2 C44.1 C45.1 C46.2 C47.2 C48.1 C49.1 C50.2 C51.2 C53.2 C54.2 C56.2 C57.2 C76.1 C81.1 C83.1 C85.1 C89.1 C90.1 C91.1 C93.1 C95.1 C96.1 C99.1 C100.1 C101.2 C102.1 CARD2.7(GND) CARD2.8(GND) CARD2.9(S/W) CARD2.10(GND) CARD2.C5(GND) CN4.1 CN4.3 CN4.4 CN5.1 CN5.3 CN5.4 CN6.1 CN6.3 CN6.4 D5.2(A) Q7.3(C) Q8.1(G) R13.2 R46.2 R47.1 R52.2 RF2.2(GND) RF2.3(GND) RF3.2(GND) RF3.3(GND) SW2.2 U1.1(GND) U1.7(GND) U1.13(GND) U1.15(GND) U1.20(GND) U1.25(GND) U1.30(GND) U1.34(GND) U1.36(GND) U1.38(GND) U1.39(GND) U1.40(GND) U1.41(GND) U1.43(GND) U1.46(GND) U1.51(GND) U1.55(GND) U1.60(GND) U1.66(GND) U1.71(GND) U1.76(GND) U1.105(GND) U1.106(GND) U1.107(GND) U1.108(GND) U1.109(GND) U1.110(GND) U1.111(GND) U1.112(GND) U1.113(GND) U5.2(GND) U5.3(CTL) U8.7(EP) U9.1(PGND) U9.4(FB) U9.10(MODE) U9.11(AGND) U10.1(PGND) U10.4(AGND) U10.9(EP) U11.1(TEMP) U11.3(GND) U11.9(PAD) U13.2(GND) U13.5(GND) U13.8(GND) U13.20(GND) U13.25(GND) U14.2(GND) U16.4 U16.9 X1.1(GND) X1.2(GND)
VBAT: C42.2 Q2.3(D) Q8.2(S) U11.5(BAT) U11.8(FB)
VDD_SX126: C43.1 C57.1 C89.2 Q3.3(D) U13.1(VDD_IN) U13.10(VBAT) U13.11(VBAT_IO)
VIN: C7.2 C13.2 Q1.2(S) Q2.2(S) R9.2 R48.2 U5.6(SENSE) U9.7(PVIN) U9.8(AVIN) U10.2(VIN)
ANT_SW: R59.1 U1.73(P0.13)
BUSY: U1.68(P0.09) U13.14(BUSY)
COEX0: C53.1 R52.1 U1.52(COEX0) U8.2(VEN)
DEB_RX: U1.69(P0.10) U16.7
DEB_TX: U1.70(P0.11) U16.8
DI01: U1.72(P0.12) U13.13(DIO1)
DI03: L26.2 U13.6(DIO3)
DIO2: C101.1 R60.1 U13.12(DIO2)
ENABLE: R53.2 U1.10(ENABLE)
ENABLE_3.3VGPIO: C17.2 R11.2 R13.1 U9.5(PG) U10.3(EN)
GPIO3V3_LORA_500MA: C15.1 C47.1 C48.2 C51.1 C54.1 L4.1 Q3.2(S) R8.1 U1.65(VDD_GPIO) U8.1(VCC) U10.6(VOS)
LORA_VOLTAGE_ENABLE: R49.1 U1.59(P0.03)
MISO: U1.62(P0.05) U13.16(MISO)
MOSI: U1.64(P0.07) U13.17(MOSI)
NRESET: U1.67(P0.08) U13.15(NRESET)
NRF9151-VDD: C3.2 C46.1 C49.2 C50.1 L27.1 U1.14(VDD)
NSS: U1.61(P0.04) U13.19(NSS)
RESET: R51.1 SW2.1 U16.5
RF_ANT: RF2.1(SIG) U1.35(ANT)
RF_AUX: C52.2 U1.37(AUX)
RF_GPS: U1.42(GPS) U8.6(RF_OUT)
SCK: U1.63(P0.06) U13.18(SCK)
SIM_CLK: CARD2.C3(CLK) U1.18(SIM_CLK)
SIM_IO: CARD2.C7(I/O) U1.17(SIM_IO)
SIM_RST: CARD2.C2(RST) U1.16(SIM_RST)
SIM_VCC: CARD2.C1(VCC) U1.19(SIM_1V8)
SOLAR_PV: C41.2 D6.1(C) Q6.2(S) U11.4(VIN)
SWDCLK: U1.3(SWDCLK) U16.3
SWDIO: U1.4(SWDIO) U16.2
$1N5599: C12.2 U9.9(SS/TR)
$1N5840: L3.1 U9.2(SW)
$1N6280: C15.2 U10.5(FB)
$1N6332: R8.2 U10.8(PG)
$1N6408: L4.2 U10.7(SW)
$1N6706: C18.2 R9.1 U9.6(EN)
$1N7225: CN4.2 Q8.3(D)
$1N7651: CN5.2 D5.1(C) Q6.3(D)
$1N7654: D6.2(A) Q6.1(G) R46.1
$1N7658: R47.2 U11.2(ISET)
$1N7845: CN6.2 Q1.3(D) U5.1(VIN)
$1N7884: Q1.1(G) U5.5(GATE)
$1N7906: Q2.1(G) R48.1 U5.4(STAT)
$1N8450: Q7.1(B) R49.2
$1N10304: Q3.1(G) Q7.2(E) R50.1
$1N10488: C44.2 R51.2 U1.9(nRESET)
$1N10935: C45.2 U1.24(DEC0)
$1N12604: C52.1 U8.3(RF_IN)
$1N15358: R57.2 U13.3(XTA)
$1N15364: C88.2 R57.1
$1N15368: C88.1 X1.3(Output)
$1N15674: U13.7(VREG) U15.2
$1N15679: U13.9(DCC_SW) U15.1
$1N16005: R58.1 U13.23(RFO)
$1N16052: C90.2 C91.2 L20.2 U13.24(VR_PA)
$1N16301: C76.2 C92.1 L20.1 L21.1 R58.2
$1N16358: C92.2 C93.2 C94.1 L21.2
$1N16409: C94.2 L22.1
$1N16412: C95.2 L22.2 U14.1(RF1)
$1N16561: C96.2 L23.1 U13.21(RFI_P)
$1N16740: C81.2 C97.2 U14.3(RF2)
$1N16747: C97.1 L23.2 U13.22(RFI_N)
$1N17013: C85.2 C102.2 R59.2 U14.6(CTRL# or VDD)
$1N17155: C98.1 U14.5(RFC)
$1N17206: C98.2 C99.2 L24.1
$1N17209: C100.2 L24.2 RF3.1(SIG)
$1N17526: C56.1 L26.1 X1.4(VCC)
$1N35658: C83.2 R60.2 U14.4(CTRL)

Not connected (* = marked no-connect by the designer): CARD2 C6(VPP)*; U1 2(P0.20)* 5(P0.21)* 6(P0.22)* 8(P0.23)* 11(P0.24)* 12(P0.25)* 21(MAGPIO0)* 22(MAGPIO1)* 23(MAGPIO2)* 26(SIM_DET)* 27(SDATA)* 28(SCLK)* 29(VIO)* 31(RESERVED)* 32(RESERVED)* 33(RESERVED)* 44(P0.26)* 45(P0.27)* 47(P0.28)* 48(P0.29)* 49(P0.30)* 50(P0.31)* 53(COEX1)* 54(COEX2)* 56(P0.00)* 57(P0.01)* 58(P0.02)* 74(P0.14)* 75(P0.15)* 77(P0.16)* 78(P0.17)* 79(P0.18)* 80(P0.19)* 81(RESERVED)* 82(RESERVED)* 83(RESERVED)* 84(RESERVED)* 85(RESERVED)* 86(RESERVED)* 87(RESERVED)* 88(RESERVED)* 89(RESERVED)* 90(RESERVED)* 91(RESERVED)* 92(RESERVED)* 93(RESERVED)* 94(RESERVED)* 95(RESERVED)* 96(RESERVED)* 97(RESERVED)* 98(RESERVED)* 99(RESERVED)* 100(RESERVED)* 101(RESERVED)* 102(RESERVED)* 103(RESERVED)* 104(RESERVED)*; U8 4(N/C)* 5(N/C)*; U11 6(DONE#)* 7(CHRG#)*; U13 4(XTB)*

## Notes on the sheet
- GILBERTO_VERSION NRF9151 _SX1262 LORA
- 1. Overview
  This design is a production-optimized modification of the open-source nRF9151 Feather platform, tailored for animal tracking applications.
  The system integrates:
  Cellular (NTN/LTE-M/NB-IoT) + GPS via nRF9151
  LoRa communication via SX1262
  Dual battery support (LiPo + Solar OR LiSOCl₂)
  Ultra-low power operation
  Compact form factor (≤ 50.8mm × 22.86mm)
  All development-board-specific and non-essential components have been removed to improve cost, efficiency, and manufacturability.
- SOLAR CHARGER
- BATTERY CONNECTOR CHARGING(3.7V-4.2V)
- 2. Removed Components
  The following features from the original Feather design are excluded:
  RP2040 co-processor
  USB-C interface
  External NOR Flash (Winbond 4MB)
  Non-essential push buttons (only Reset retained)
  QWIIC connector
- 4.3 Voltage Regulation Strategy
  Instead of a PMIC (e.g., nPM1300), the design uses:
  Two buck regulators (Master + Slave)
  Controlled using RC timing + PGOOD logic
  Eliminates need for external microcontroller for sequencing
  5. Power Sequencing (Critical Design)
  The system uses RC-based timing (“power inertia”) to meet nRF9151 strict requirements:
  VDD (core) must power ON first and OFF last
  VDD_GPIO must power OFF first
  5.1 Master Rail (Main 3.3V – Core Supply)
  Components:
  100kΩ resistor
  10µF capacitor
  Behavior:
  Startup delay: ~700ms
  Shutdown delay: ~1000ms
  Purpose:
  Provides stable core voltage
  Allows:
  LTE modem network detach
  Safe flash memory writes
  System state preservation
  5.2 Slave Rail (GPIO Supply – Fast Rail)
  Components:
  100kΩ pull-down
  10nF capacitor
  Behavior:
  Startup: activates after master reaches ~95%
  Shutdown: discharges in ~1ms
  Purpose:
  Ensures GPIO power drops before core power
  Prevents back-powering through I/O pins
  Protects nRF9151 integrity
- SOLAR PANEL CONNECTOR LIPO 1 WATT
- 3. Core Functional Blocks
  3.1 Main Processing Unit
  nRF9151 SiP
  Integrated LTE-M / NB-IoT / NTN modem
  Integrated GPS
  Main MCU for system control
  Interfaces with LoRa module and power control logic
- BATTERY CONNECTOR LiSOCL2 NOT CHARGEABLE (3.7V)
- POWER PATH MANAGER FOR BATTERIES
- 3.2 LoRa Communication
  SX1262 (SMD 16×16mm module)
  SPI-connected to nRF9151
  Controlled via GPIO (including power gating)
  External U.FL antenna connector
  Internal RF matching (no external matching network required)
  Optimized for low-cost (~$2.8) and long-range communication
- GILBERTO_VERSION NRF9151 _SX1262 LORA
- 4. Power Architecture
  4.1 Dual Battery Support
  The system supports two mutually exclusive power configurations:
  LiPo Battery (Rechargeable)
  Charged via solar input
  Managed by CN3165 solar charge controller
  LiSOCl₂ Battery (Primary)
  Non-rechargeable
  Used for ultra-long-life deployments
- SIMCARD_SLOT
- 4.2 Power Path Management
  LTC4412 Ideal Diode Controller
  Automatically selects active power source
  Prevents reverse current
  Ensures seamless switching between battery types
- 7. Solar Charging System
  CN3165 Solar Charge Controller
  Handles LiPo charging from solar panel
  Efficient energy harvesting
  Supports autonomous field deployment
- JTAG HEADER
- NC
- SERIAL DEBUG HEADER
- NC
- NC resistor value if needed
- LORA_SX1262
